# EasyEDA schematic Irrigatron.json
TITLE: Sheet_1; REV: 1.0; Date: 2023-08-09; Sheet: 1/1; Company: Your Company
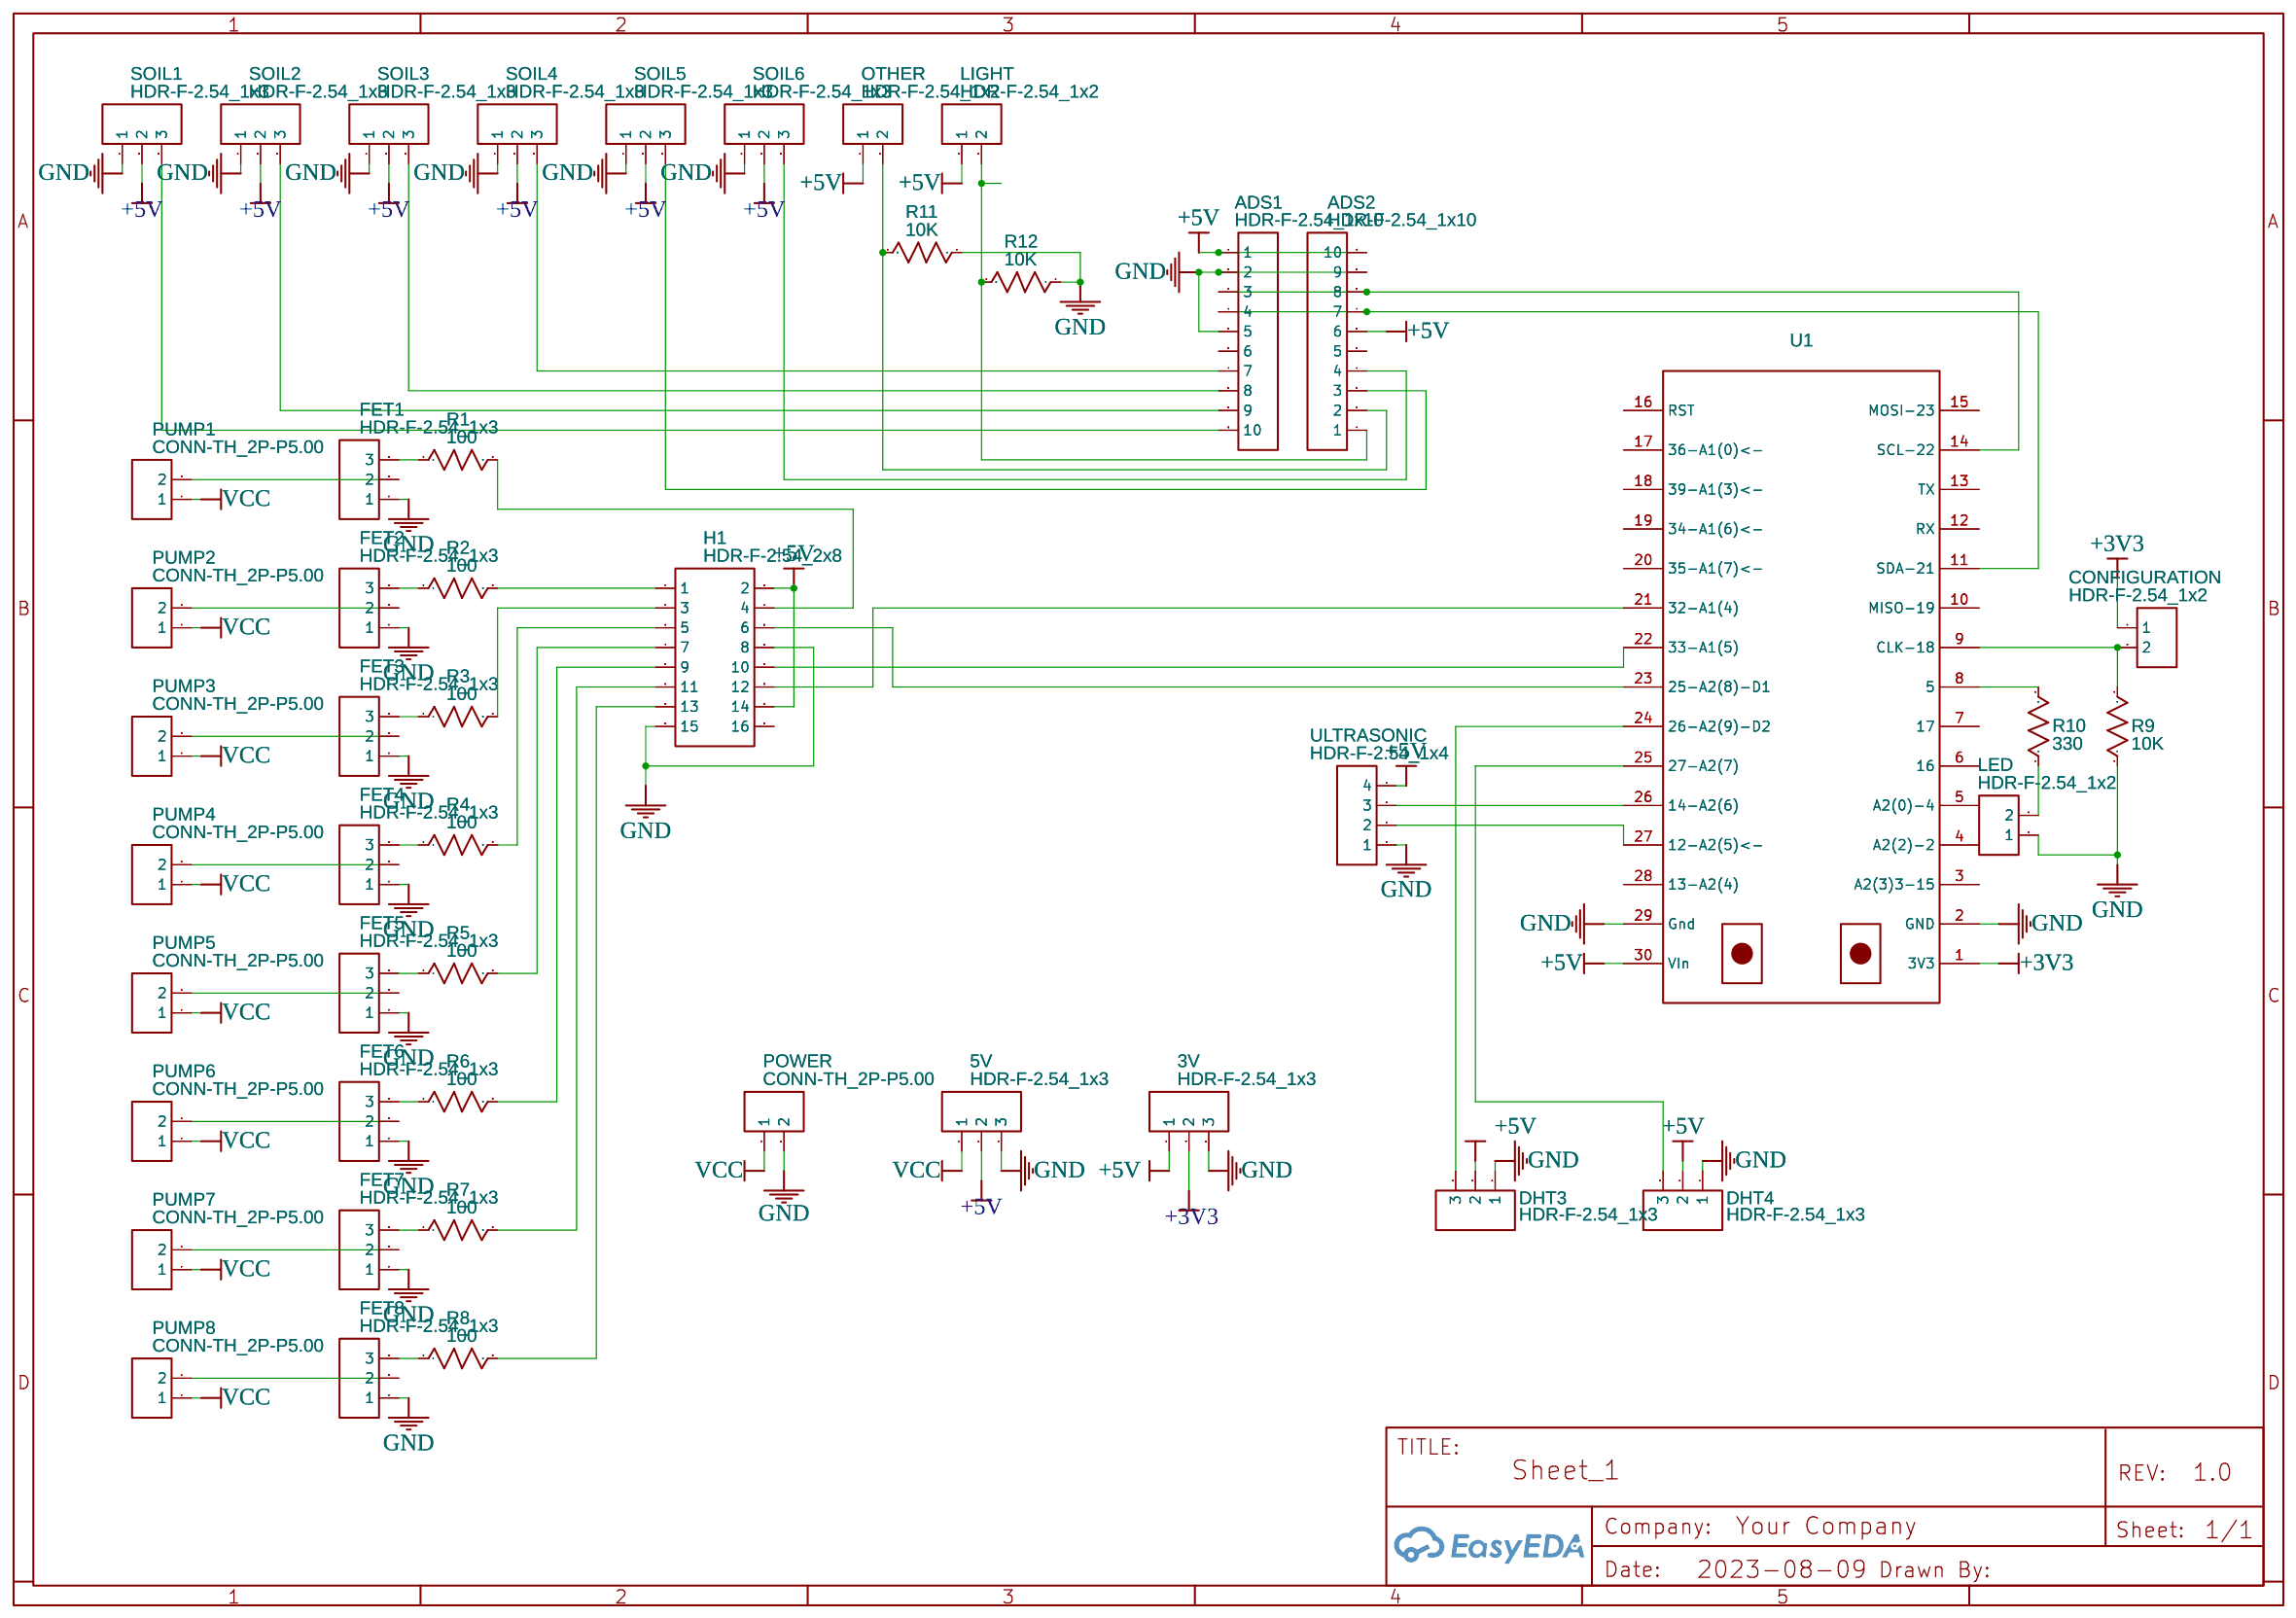
[diagram p0: schematic sheet]

## Parts
3V  HDR-F-2.54_1x3  [HDR-F-2.54_1X3]
5V  HDR-F-2.54_1x3  [HDR-F-2.54_1X3]
ADS1  HDR-F-2.54_1x10  [HDR-F-2.54_1X10]
ADS2  HDR-F-2.54_1x10  [HDR-F-2.54_1X10]
CONFIGURATION  HDR-F-2.54_1x2  [HDR-F-2.54_1X2]
DHT3  HDR-F-2.54_1x3  [HDR-F-2.54_1X3]
DHT4  HDR-F-2.54_1x3  [HDR-F-2.54_1X3]
FET1  HDR-F-2.54_1x3  [HDR-F-2.54_1X3]
FET2  HDR-F-2.54_1x3  [HDR-F-2.54_1X3]
FET3  HDR-F-2.54_1x3  [HDR-F-2.54_1X3]
FET4  HDR-F-2.54_1x3  [HDR-F-2.54_1X3]
FET5  HDR-F-2.54_1x3  [HDR-F-2.54_1X3]
FET6  HDR-F-2.54_1x3  [HDR-F-2.54_1X3]
FET7  HDR-F-2.54_1x3  [HDR-F-2.54_1X3]
FET8  HDR-F-2.54_1x3  [HDR-F-2.54_1X3]
H1  HDR-F-2.54_2x8  [HDR-F-2.54_2X8]
LED  HDR-F-2.54_1x2  [HDR-F-2.54_1X2]
LIGHT  HDR-F-2.54_1x2  [HDR-F-2.54_1X2]
OTHER  HDR-F-2.54_1x2  [HDR-F-2.54_1X2]
POWER  CONN-TH_2P-P5.00  [CONN-TH_2P-P5.00]
PUMP1  CONN-TH_2P-P5.00  [CONN-TH_2P-P5.00]
PUMP2  CONN-TH_2P-P5.00  [CONN-TH_2P-P5.00]
PUMP3  CONN-TH_2P-P5.00  [CONN-TH_2P-P5.00]
PUMP4  CONN-TH_2P-P5.00  [CONN-TH_2P-P5.00]
PUMP5  CONN-TH_2P-P5.00  [CONN-TH_2P-P5.00]
PUMP6  CONN-TH_2P-P5.00  [CONN-TH_2P-P5.00]
PUMP7  CONN-TH_2P-P5.00  [CONN-TH_2P-P5.00]
PUMP8  CONN-TH_2P-P5.00  [CONN-TH_2P-P5.00]
R1  100  [R0603]
R2  100  [R0603]
R3  100  [R0603]
R4  100  [R0603]
R5  100  [R0603]
R6  100  [R0603]
R7  100  [R0603]
R8  100  [R0603]
R9  10K  [R0603]
R10  330  [R0603]
R11  10K  [R0603]
R12  10K  [R0603]
SOIL1  HDR-F-2.54_1x3  [HDR-F-2.54_1X3]
SOIL2  HDR-F-2.54_1x3  [HDR-F-2.54_1X3]
SOIL3  HDR-F-2.54_1x3  [HDR-F-2.54_1X3]
SOIL4  HDR-F-2.54_1x3  [HDR-F-2.54_1X3]
SOIL5  HDR-F-2.54_1x3  [HDR-F-2.54_1X3]
SOIL6  HDR-F-2.54_1x3  [HDR-F-2.54_1X3]
U1  NO  [DOIT ESP32 DEVKIT V1 (30PINS)]
ULTRASONIC  HDR-F-2.54_1x4  [HDR-F-2.54_1X4]

## Library data of the parts
3V 5V DHT3 DHT4 FET1-FET8 SOIL1-SOIL6 = HDR-F-2.54_1x3: Supplier Part: C146690; Supplier: LCSC; Contributor: LCEDA_Lib
ADS1 ADS2 = HDR-F-2.54_1x10: Supplier Part: C35445; Supplier: LCSC; Contributor: LCEDA_Lib
CONFIGURATION LED LIGHT OTHER = HDR-F-2.54_1x2: Supplier Part: C49661; Supplier: LCSC; Contributor: LCEDA_Lib
H1 = HDR-F-2.54_2x8: Supplier Part: C30734; Supplier: LCSC; Contributor: LCEDA_Lib
POWER PUMP1-PUMP8 = CONN-TH_2P-P5.00: Supplier: LCSC; Contributor: LCEDA_Lib
R1-R12 = R_0603_US: Contributor: LCEDA_Lib
U1 = DOIT ESP32 DEVKIT V1 (30pins): Contributor: BrIs1063
ULTRASONIC = HDR-F-2.54_1x4: Supplier Part: C225501; Supplier: LCSC; Contributor: LCEDA_Lib

## Nets
+3V3: 3V.2 CONFIGURATION.1 U1.1(3V3)
+5V: 3V.1 5V.2 ADS1.1 ADS2.6 ADS2.10 DHT3.2 DHT4.2 H1.2 H1.14 LIGHT.1 OTHER.1 SOIL1.2 SOIL2.2 SOIL3.2 SOIL4.2 SOIL5.2 SOIL6.2 U1.30(VIn) ULTRASONIC.4
GND: 3V.3 5V.3 ADS1.2 ADS1.5 ADS2.9 DHT3.1 DHT4.1 FET1.1 FET2.1 FET3.1 FET4.1 FET5.1 FET6.1 FET7.1 FET8.1 H1.8 H1.15 LED.1 POWER.2 R9.1 R11.1 R12.1 SOIL1.1 SOIL2.1 SOIL3.1 SOIL4.1 SOIL5.1 SOIL6.1 U1.2(GND) U1.29(Gnd) ULTRASONIC.1
VCC: 5V.1 POWER.1 PUMP1.1 PUMP2.1 PUMP3.1 PUMP4.1 PUMP5.1 PUMP6.1 PUMP7.1 PUMP8.1
Net-(ADS1-3): ADS1.3 ADS2.8 U1.14(SCL-22)
Net-(ADS1-4): ADS1.4 ADS2.7 U1.11(SDA-21)
Net-(ADS1-7): ADS1.7 SOIL4.3
Net-(ADS1-8): ADS1.8 SOIL3.3
Net-(ADS1-9): ADS1.9 SOIL2.3
Net-(ADS1-10): ADS1.10 SOIL1.3
Net-(ADS2-1): ADS2.1 LIGHT.2 R12.2
Net-(ADS2-2): ADS2.2 OTHER.2 R11.2
Net-(ADS2-3): ADS2.3 SOIL5.3
Net-(ADS2-4): ADS2.4 SOIL6.3
Net-(CONFIGURATION-2): CONFIGURATION.2 R9.2 U1.9(CLK-18)
Net-(DHT3-3): DHT3.3 U1.24(26-A2(9)-D2)
Net-(DHT4-3): DHT4.3 U1.25(27-A2(7))
Net-(FET1-2): FET1.2 PUMP1.2
Net-(FET1-3): FET1.3 R1.1
Net-(FET2-2): FET2.2 PUMP2.2
Net-(FET2-3): FET2.3 R2.1
Net-(FET3-2): FET3.2 PUMP3.2
Net-(FET3-3): FET3.3 R3.1
Net-(FET4-2): FET4.2 PUMP4.2
Net-(FET4-3): FET4.3 R4.1
Net-(FET5-2): FET5.2 PUMP5.2
Net-(FET5-3): FET5.3 R5.1
Net-(FET6-2): FET6.2 PUMP6.2
Net-(FET6-3): FET6.3 R6.1
Net-(FET7-2): FET7.2 PUMP7.2
Net-(FET7-3): FET7.3 R7.1
Net-(FET8-2): FET8.2 PUMP8.2
Net-(FET8-3): FET8.3 R8.1
Net-(H1-1): H1.1 R2.2
Net-(H1-3): H1.3 R3.2
Net-(H1-4): H1.4 R1.2
Net-(H1-5): H1.5 R4.2
Net-(H1-6): H1.6 U1.23(25-A2(8)-D1)
Net-(H1-7): H1.7 R5.2
Net-(H1-9): H1.9 R6.2
Net-(H1-10): H1.10 U1.22(33-A1(5))
Net-(H1-11): H1.11 R7.2
Net-(H1-12): H1.12 U1.21(32-A1(4))
Net-(H1-13): H1.13 R8.2
Net-(LED-2): LED.2 R10.1
Net-(R10-2): R10.2 U1.8(5)
Net-(U1-26): U1.26(14-A2(6)) ULTRASONIC.3
Net-(U1-27): U1.27(12-A2(5)<-) ULTRASONIC.2

Not connected (* = marked no-connect by the designer): ADS1 6; ADS2 5; H1 16; U1 3(A2(3)3-15) 4(A2(2)-2) 5(A2(0)-4) 6(16) 7(17) 10(MISO-19) 12(RX) 13(TX) 15(MOSI-23) 16(RST) 17(36-A1(0)<-) 18(39-A1(3)<-) 19(34-A1(6)<-) 20(35-A1(7)<-) 28(13-A2(4))
